# EAGLE design V1.3 (EAGLE 9.1.3)
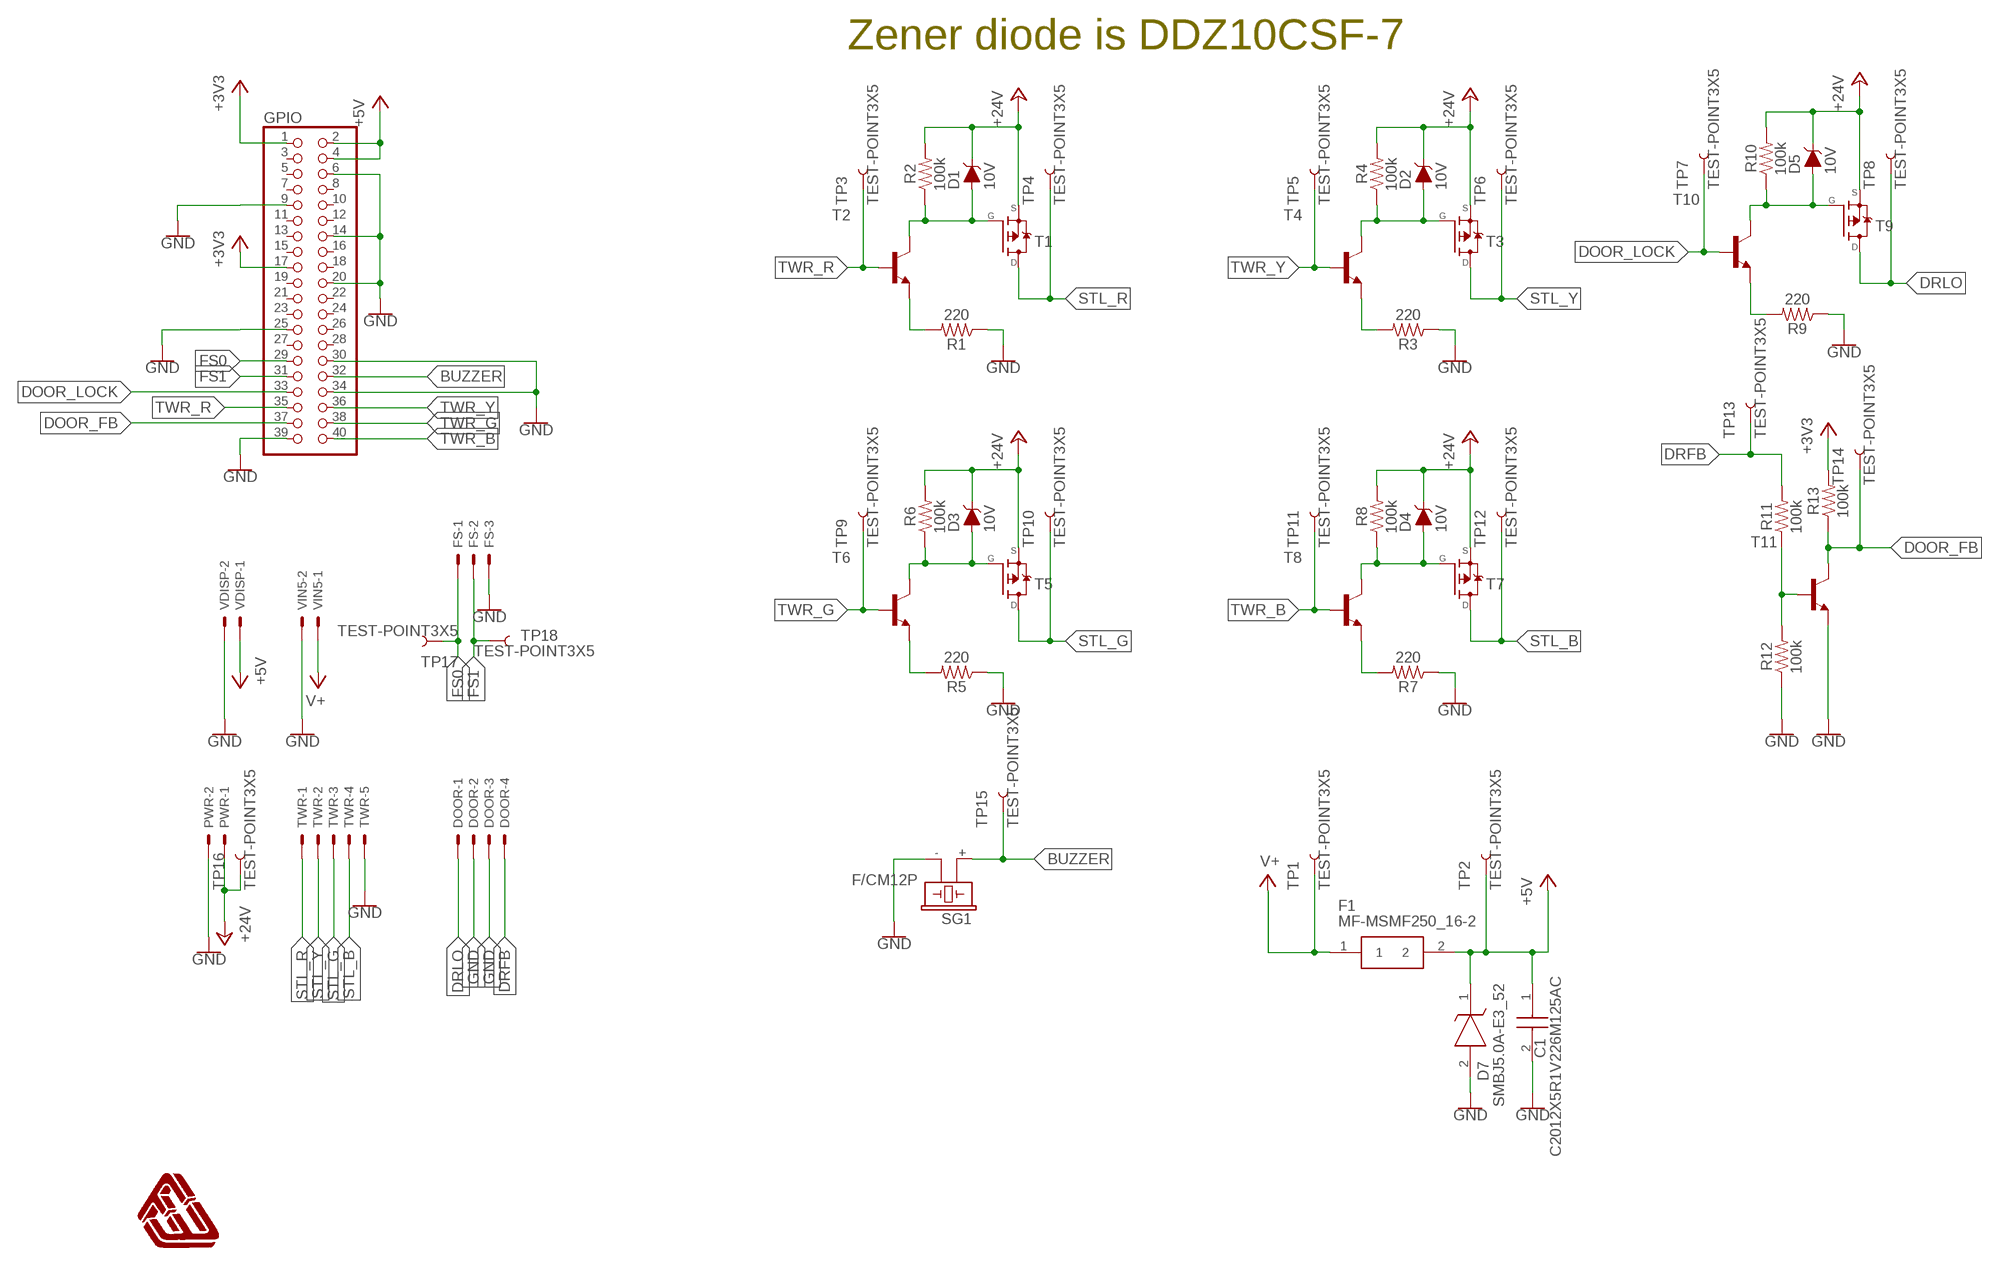
[diagram p0: schematic, sheet 1]

## Parts
C1  C2012X5R1V226M125AC  [CAPC2012X145N]
D1  10V  DIODE-ZENER-DZ2J150M0L  [PANASONIC_SMINI2-F5-B]
D2  10V  DIODE-ZENER-DZ2J150M0L  [PANASONIC_SMINI2-F5-B]
D3  10V  DIODE-ZENER-DZ2J150M0L  [PANASONIC_SMINI2-F5-B]
D4  10V  DIODE-ZENER-DZ2J150M0L  [PANASONIC_SMINI2-F5-B]
D5  10V  DIODE-ZENER-DZ2J150M0L  [PANASONIC_SMINI2-F5-B]
D7  SMBJ5.0A-E3_52  [DIOM5436X244N]
DOOR  JST-XH-04-PIN-LONG-PAD  [JST-XH-04-PACKAGE-LONG-PAD]
F1  MF-MSMF250_16-2  [FUSC4632X160N]
FS  JST-XH-03-PIN-LONG-PAD  [JST-XH-03-PACKAGE-LONG-PAD]
GPIO  RASPBERRYPI_3B_GPIO  [RASPBERRYPI_3B_GPIO]
PWR  JST-XH-02-PIN-LONG-PAD  [JST-XH-02-PACKAGE-LONG-PAD]
R1  220  100KOHM-0603-1/10W-1%  [0603]
R2  100k  100KOHM-0603-1/10W-1%  [0603]
R3  220  100KOHM-0603-1/10W-1%  [0603]
R4  100k  100KOHM-0603-1/10W-1%  [0603]
R5  220  100KOHM-0603-1/10W-1%  [0603]
R6  100k  100KOHM-0603-1/10W-1%  [0603]
R7  220  100KOHM-0603-1/10W-1%  [0603]
R8  100k  100KOHM-0603-1/10W-1%  [0603]
R9  220  100KOHM-0603-1/10W-1%  [0603]
R10  100k  100KOHM-0603-1/10W-1%  [0603]
R11  100k  100KOHM-0603-1/10W-1%  [0603]
R12  100k  100KOHM-0603-1/10W-1%  [0603]
R13  100k  100KOHM-0603-1/10W-1%  [0603]
SG1  F/CM12P  [F/CM12P]
T1  MOSFET_P_SOT223  [MOSFET_SOT223]
T2  MMBT3904LT1-NPN-SOT23-BEC  [SOT23-BEC]
T3  MOSFET_P_SOT223  [MOSFET_SOT223]
T4  MMBT3904LT1-NPN-SOT23-BEC  [SOT23-BEC]
T5  MOSFET_P_SOT223  [MOSFET_SOT223]
T6  MMBT3904LT1-NPN-SOT23-BEC  [SOT23-BEC]
T7  MOSFET_P_SOT223  [MOSFET_SOT223]
T8  MMBT3904LT1-NPN-SOT23-BEC  [SOT23-BEC]
T9  MOSFET_P_SOT223  [MOSFET_SOT223]
T10  MMBT3904LT1-NPN-SOT23-BEC  [SOT23-BEC]
T11  MMBT3904LT1-NPN-SOT23-BEC  [SOT23-BEC]
TP1  TEST-POINT3X5  [PAD.03X.05]
TP2  TEST-POINT3X5  [PAD.03X.05]
TP3  TEST-POINT3X5  [PAD.03X.05]
TP4  TEST-POINT3X5  [PAD.03X.05]
TP5  TEST-POINT3X5  [PAD.03X.05]
TP6  TEST-POINT3X5  [PAD.03X.05]
TP7  TEST-POINT3X5  [PAD.03X.05]
TP8  TEST-POINT3X5  [PAD.03X.05]
TP9  TEST-POINT3X5  [PAD.03X.05]
TP10  TEST-POINT3X5  [PAD.03X.05]
TP11  TEST-POINT3X5  [PAD.03X.05]
TP12  TEST-POINT3X5  [PAD.03X.05]
TP13  TEST-POINT3X5  [PAD.03X.05]
TP14  TEST-POINT3X5  [PAD.03X.05]
TP15  TEST-POINT3X5  [PAD.03X.05]
TP16  TEST-POINT3X5  [PAD.03X.05]
TP17  TEST-POINT3X5  [PAD.03X.05]
TP18  TEST-POINT3X5  [PAD.03X.05]
TWR  JST-XH-05-PIN-LONG-PAD  [JST-XH-05-PACKAGE-LONG-PAD]
U$5  FWLOGO  [FWLOGO]
VDISP  JST-XH-02-PIN-LONG-PAD  [JST-XH-02-PACKAGE-LONG-PAD]
VIN5  JST-XH-02-PIN-LONG-PAD  [JST-XH-02-PACKAGE-LONG-PAD]

## Nets
+3V3: GPIO.1 GPIO.17 R13.2
+5V: C1.1 D7.1(K) F1.2 GPIO.2 GPIO.4 TP2.P$1 VDISP.1
+24V: D1.C D2.C D3.C D4.C D5.C PWR.1 R2.2 R4.2 R6.2 R8.2 R10.2 T1.3(S) T3.3(S) T5.3(S) T7.3(S) T9.3(S) TP16.P$1
BUZZER: GPIO.32 SG1.+ TP15.P$1
DOOR_FB: GPIO.37 R13.1 T11.C TP14.P$1
DOOR_LOCK: GPIO.33 T10.B TP7.P$1
DRFB: DOOR.4 R11.2 TP13.P$1
DRLO: DOOR.1 T9.2(D) T9.4(D) TP8.P$1
FS0: FS.1 GPIO.29 TP17.P$1
FS1: FS.2 GPIO.31 TP18.P$1
GND: C1.2 D7.2(A) DOOR.2 DOOR.3 FS.3 GPIO.6 GPIO.9 GPIO.14 GPIO.20 GPIO.25 GPIO.30 GPIO.34 GPIO.39 PWR.2 R1.1 R3.1 R5.1 R7.1 R9.1 R12.1 SG1.- T11.E TWR.5 VDISP.2 VIN5.2
N$1: R1.2 T2.E
N$3: D2.A R4.1 T3.1(G) T4.C
N$4: D1.A R2.1 T1.1(G) T2.C
N$5: R11.1 R12.2 T11.B
N$8: R3.2 T4.E
N$9: D3.A R6.1 T5.1(G) T6.C
N$10: R5.2 T6.E
N$11: D4.A R8.1 T7.1(G) T8.C
N$12: R7.2 T8.E
N$13: D5.A R10.1 T9.1(G) T10.C
N$14: R9.2 T10.E
STL_B: T7.2(D) T7.4(D) TP12.P$1 TWR.4
STL_G: T5.2(D) T5.4(D) TP10.P$1 TWR.3
STL_R: T1.2(D) T1.4(D) TP4.P$1 TWR.1
STL_Y: T3.2(D) T3.4(D) TP6.P$1 TWR.2
TWR_B: GPIO.40 T8.B TP11.P$1
TWR_G: GPIO.38 T6.B TP9.P$1
TWR_R: GPIO.35 T2.B TP3.P$1
TWR_Y: GPIO.36 T4.B TP5.P$1
V+: F1.1 TP1.P$1 VIN5.1
Unconnected: GPIO.3 GPIO.5 GPIO.7 GPIO.8 GPIO.10 GPIO.11 GPIO.12 GPIO.13 GPIO.15 GPIO.16 GPIO.18 GPIO.19 GPIO.21 GPIO.22 GPIO.23 GPIO.24 GPIO.26 GPIO.27 GPIO.28

## Notes on the sheet
- Zener diode is DDZ10CSF-7

## Library data of the parts
C1 = SamacSys_Parts:C2012X5R1V226M125AC: TDK 0805 C 22uF Ceramic Multilayer Capacitor, 35 V dc, +85C, X5R Dielectric, +/-20% Source: Datasheet <https://product.tdk.com/info/en/catalog/datasheets/mlcc_commercial_midvoltage_en.pdf>; DESCRIPTION: TDK 0805 C 22uF Ceramic Multilayer Capacitor, 35 V dc, +85C, X5R Dielectric, +/-20%; HEIGHT: 1.45mm; MANUFACTURER_NAME: TDK; MANUFACTURER_PART_NUMBER: C2012X5R1V226M125AC; MOUSER_PART_NUMBER: 810-C2012X5R1V226MAC; MOUSER_PRICE-STOCK: https://www.mouser.com/Search/Refine.aspx?Keyword=810-C2012X5R1V226MAC; RS_PART_NUMBER: 9159334P; RS_PRICE-STOCK: http://uk.rs-online.com/web/p/products/9159334P
D1-D5 = SparkFun-DiscreteSemi:DIODE-ZENER: Zener Diode A Zener diode allows current to flow from its anode to its cathode like a normal semiconductor diode, but it also permits current to flow in the reverse direction when its "Zener voltage" is reached. - WIkipedia; PROD_ID: DIO-12989; VALUE: 15V
D7 = SamacSys_Parts:SMBJ5.0A-E3_52: Vishay SMBJ5.0A-E3/52, Uni-Directional TVS Diode, 600W, 2-Pin DO-214AA Source: Datasheet <https://www.vishay.com/docs/88392/smbj.pdf>; ALLIED_NUMBER: 70217303; ALLIED_PRICE-STOCK: https://www.alliedelec.com/generalsemiconductor-vishay-smbj5-0a-e3-52/70217303/; DESCRIPTION: Vishay SMBJ5.0A-E3/52, Uni-Directional TVS Diode, 600W, 2-Pin DO-214AA; HEIGHT: 2.44mm; MANUFACTURER_NAME: Vishay; MANUFACTURER_PART_NUMBER: SMBJ5.0A-E3/52; MOUSER_PART_NUMBER: 625-SMBJ5.0A-E3; MOUSER_PRICE-STOCK: https://www.mouser.com/Search/Refine.aspx?Keyword=625-SMBJ5.0A-E3; RS_PART_NUMBER: 1652507; RS_PRICE-STOCK: http://uk.rs-online.com/web/p/products/1652507
DOOR = Rembrandt:JST-XH-04-PIN: JST XH Connector 2 Pin Wire to board connector. Pitch: 2,54 mm, (0.100") Number of pins: 4 Created by Rembrandt Electronics www.rembrandtelectronics.com
F1 = SamacSys_Parts:MF-MSMF250_16-2: BOURNS - MF-MSMF250/16-2 - FUSE, RESETTABLE PTC, 16V, 2.5A, 1812 Source: Datasheet <https://www.bourns.com/pdfs/mfmsmf.pdf>; DESCRIPTION: BOURNS - MF-MSMF250/16-2 - FUSE, RESETTABLE PTC, 16V, 2.5A, 1812; HEIGHT: 1.6mm; MANUFACTURER_NAME: Bourns; MANUFACTURER_PART_NUMBER: MF-MSMF250/16-2; MOUSER_PART_NUMBER: 652-MF-MSMF250/16-2; MOUSER_PRICE-STOCK: https://www.mouser.com/Search/Refine.aspx?Keyword=652-MF-MSMF250%2F16-2; RS_PART_NUMBER: 6478229P; RS_PRICE-STOCK: http://uk.rs-online.com/web/p/products/6478229P
FS = Rembrandt:JST-XH-03-PIN: JST XH Connector 2 Pin Wire to board connector. Pitch: 2,54 mm, (0.100") Number of pins: 3 Created by Rembrandt Electronics www.rembrandtelectronics.com
GPIO = FracktalWorks:RASPBERRYPI_3B_GPIO
PWR VDISP VIN5 = Rembrandt:JST-XH-02-PIN: JST XH Connector 2 Pin Wire to board connector. Pitch: 2,54 mm, (0.100") Number of pins: 2 Created by Rembrandt Electronics www.rembrandtelectronics.com
R1 R3 R5 R7 R9 = SparkFun-Resistors:100KOHM: 100kΩ resistor A resistor is a passive two-terminal electrical component that implements electrical resistance as a circuit element. Resistors act to reduce current flow, and, at the same time, act to lower voltage levels within circuits. - Wikipedia; PROD_ID: RES-07828; VALUE: 100k
R2 R4 R6 R8 R10-R13 = SparkFun-Resistors:100KOHM: 100kΩ resistor A resistor is a passive two-terminal electrical component that implements electrical resistance as a circuit element. Resistors act to reduce current flow, and, at the same time, act to lower voltage levels within circuits. - Wikipedia; PROD_ID: RES-07828
SG1 = buzzer:F/CM12P: BUZZER Source: Buerklin; OC_FARNELL: unknown; OC_NEWARK: unknown
T1 T3 T5 T7 T9 = FracktalWorks:MOSFET_P_SOT223: MOSFET P channel SOT-223 device
T2 T4 T6 T8 T10 T11 = transistor:*-NPN-: NPN Transistror BF959 corrected 2008.03.06
TP1-TP18 = SparkFun-Connectors:TEST-POINT: SparkFun Test Points Bare copper test points for troubleshooting or In-Circuit-Testing. These are used by our Production team for verifying production board runs using pogo-pins on test beds. SparkFun Products: SparkFun LSM9DS1 Breakout <https://www.sparkfun.com/products/13284> SparkFun PSOC <https://www.sparkfun.com/products/13714> SparkFun Load Cell Amplifier <https://www.sparkfun.com/products/13879>
TWR = Rembrandt:JST-XH-05-PIN: JST XH Connector 2 Pin Wire to board connector. Pitch: 2,54 mm, (0.100") Number of pins: 5 Created by Rembrandt Electronics www.rembrandtelectronics.com
U$5 = FracktalWorks:FWLOGO

## Board
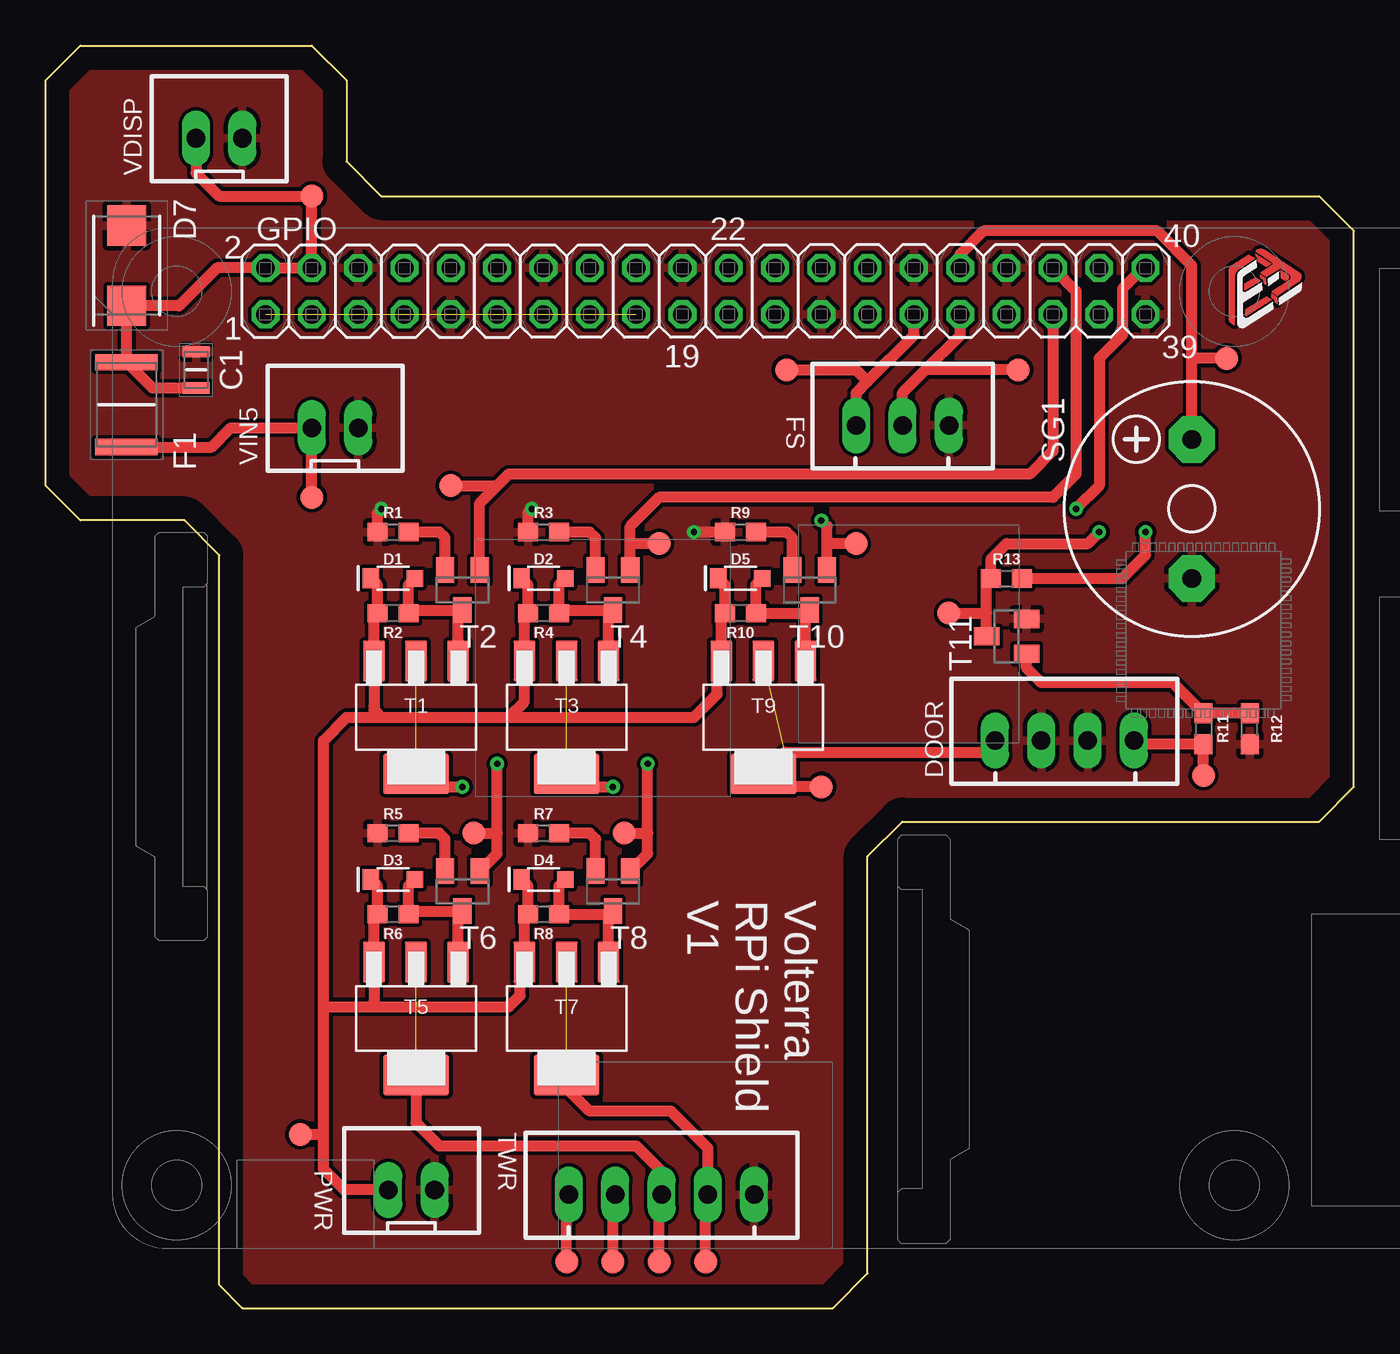
[diagram p1: board, top side]
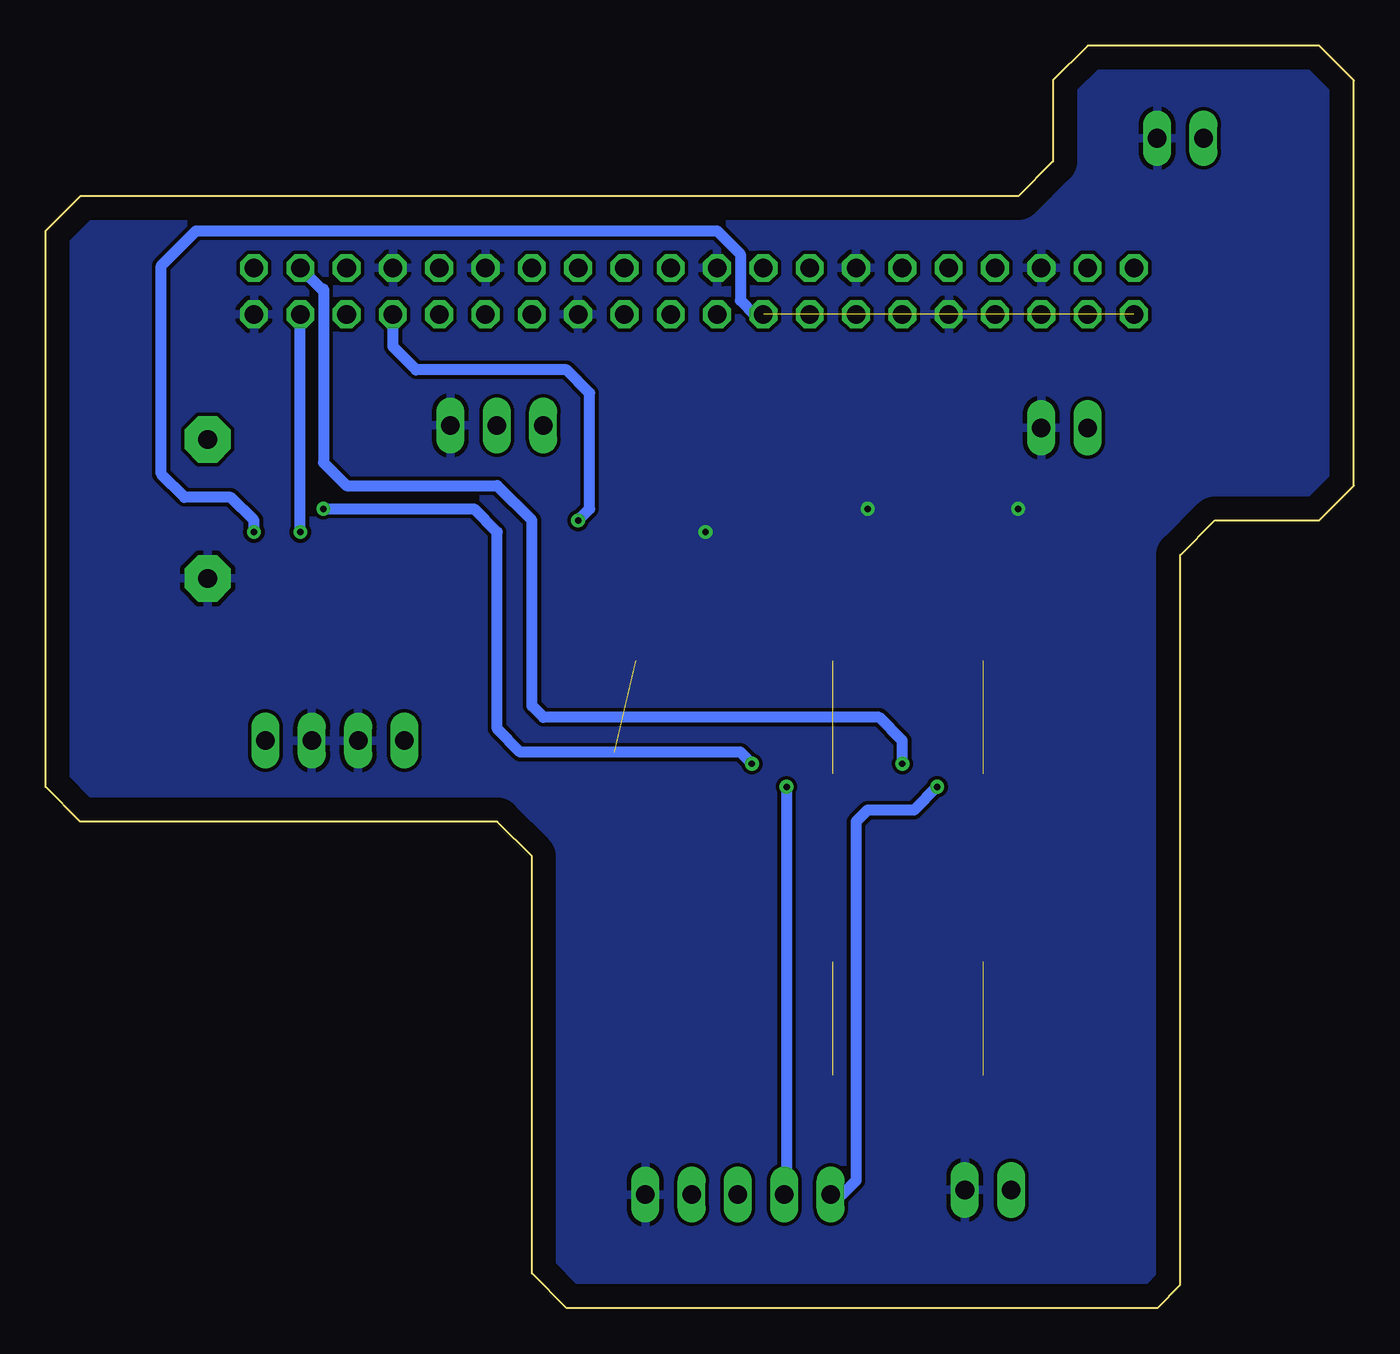
[diagram p2: board, bottom side, seen from below]

Size 71.75 x 69.22 mm. Coordinates in mm from the lower left corner, seen from the top.
Outline: 10.79,0 43.18,0 45.09,1.9 45.09,24.77 46.99,26.67 69.85,26.67 71.75,28.57 71.75,59.06 69.85,60.96 18.41,60.96 16.51,62.86 16.51,67.31 14.61,69.22 1.91,69.22 0,67.31 0,45.08 1.91,43.18 7.62,43.18 9.53,41.28 9.53,1.27 10.79,0
Copper layers (1*16): Top 0.035mm / dielectric 1.5mm / Bottom 0.035mm
Design rules "LionCircuits": minimum track width 8mil, minimum drill 0.35mm, track to track 8mil, track to pad 8mil, pad to pad 8mil, via to via 8mil, smd to smd 8mil, copper to edge 50mil, drill to drill 10mil, minimum pad ring 10mil, minimum via ring 8mil, stop-mask expansion 4mil, vias tented up to drill 0mil, thermal gap 10mil

### Footprints (pad centres in the part's own frame; a part is rotated, then mirrored left to right if it is on the bottom)
CAPC2012X145N = smd 0.62 x 1.47: 1 -1,0; 2 1,0
PANASONIC_SMINI2-F5-B = smd 0.9 x 0.9: A 1.2,0 | smd 0.9 x 1.1: C -1.2,0
DIOM5436X244N = smd 2.2 x 2.15: 1 -2.2,0; 2 2.2,0
JST-XH-04-PACKAGE-LONG-PAD = drill 1.016 long: 1 -3.81,0; 2 -1.27,0; 3 1.27,0; 4 3.81,0
FUSC4632X160N = smd 0.89 x 3.43: 1 -2.325,0; 2 2.325,0
JST-XH-03-PACKAGE-LONG-PAD = drill 1.016 long: 1 -2.54,0; 2 0,0; 3 2.54,0
RASPBERRYPI_3B_GPIO = drill 1.016 octagon: 1 -24.13,-1.27; 2 -24.13,1.27; 3 -21.59,-1.27; 4 -21.59,1.27; 5 -19.05,-1.27; 6 -19.05,1.27; 7 -16.51,-1.27; 8 -16.51,1.27; 9 -13.97,-1.27; 10 -13.97,1.27; 11 -11.43,-1.27; 12 -11.43,1.27; 13 -8.89,-1.27; 14 -8.89,1.27; 15 -6.35,-1.27; 16 -6.35,1.27; 17 -3.81,-1.27; 18 -3.81,1.27; 19 -1.27,-1.27; 20 -1.27,1.27; 21 1.27,-1.27; 22 1.27,1.27; 23 3.81,-1.27; 24 3.81,1.27; 25 6.35,-1.27; 26 6.35,1.27; 27 8.89,-1.27; 28 8.89,1.27; 29 11.43,-1.27; 30 11.43,1.27; 31 13.97,-1.27; 32 13.97,1.27; 33 16.51,-1.27; 34 16.51,1.27; 35 19.05,-1.27; 36 19.05,1.27; 37 21.59,-1.27; 38 21.59,1.27; 39 24.13,-1.27; 40 24.13,1.27
JST-XH-02-PACKAGE-LONG-PAD = drill 1.016 long: 1 -1.27,0; 2 1.27,0
0603 = smd 1.1 x 1: 1 -0.85,0; 2 0.85,0
F/CM12P = drill 1.016 pad 2.54 octagon: + 3.81,0; - -3.81,0
MOSFET_SOT223 = smd 2.235 x 1.219: 1 -3.099,2.311; 2 -3.099,0; 3 -3.099,-2.311 | smd 2.2 x 3.6: 4 3.099,0
SOT23-BEC = smd 1 x 1.4: B -0.95,-1.1; C 0,1.1; E 0.95,-1.1
PAD.03X.05 = smd 1.27 x 1.27: P$1 0,0
JST-XH-05-PACKAGE-LONG-PAD = drill 1.016 long: 1 -5.08,0; 2 -2.54,0; 3 0,0; 4 2.54,0; 5 5.08,0

### Placement (x,y rotation side)
C1  8.26,51.44 90 top
D1  19.05,40 0 top
D2  27.3,40 0 top
D3  19.05,23.5 0 top
D4  27.3,23.5 0 top
D5  38.1,40 0 top
D7  4.44,57.15 90 top
DOOR  55.88,31.11 0 top
F1  4.44,49.53 90 top
FS  47,48.39 0 top
GPIO  36.2,55.75 0 top
PWR  20.07,6.48 0 top
R1  19.05,42.55 0 top
R2  19.05,38.1 180 top
R3  27.3,42.55 0 top
R4  27.3,38.1 180 top
R5  19.05,26.04 0 top
R6  19.05,21.59 180 top
R7  27.3,26.04 0 top
R8  27.3,21.59 180 top
R9  38.1,42.55 0 top
R10  38.1,38.1 180 top
R11  63.5,31.75 270 top
R12  66.04,31.75 90 top
R13  52.7,40 0 top
SG1  62.86,43.81 90 top
T1  20.32,32.39 270 top
T2  22.86,39.37 180 top
T3  28.57,32.39 270 top
T4  31.12,39.37 180 top
T5  20.32,15.88 270 top
T6  22.86,22.86 180 top
T7  28.57,15.88 270 top
T8  31.12,22.86 180 top
T9  39.37,32.39 270 top
T10  41.91,39.37 180 top
T11  52.7,36.83 90 top
TP1  14.61,44.45 0 top
TP2  14.61,60.96 0 top
TP3  22.22,45.08 0 top
TP4  28.57,2.54 0 top
TP5  33.66,41.91 0 top
TP6  31.12,2.54 0 top
TP7  44.45,41.91 0 top
TP8  42.55,28.57 0 top
TP9  23.49,26.04 0 top
TP10  33.66,2.54 0 top
TP11  31.75,26.04 0 top
TP12  36.2,2.54 0 top
TP13  63.5,29.21 0 top
TP14  49.53,38.1 0 top
TP15  64.77,52.07 0 top
TP16  13.97,9.53 0 top
TP17  40.64,51.44 0 top
TP18  53.34,51.44 0 top
TWR  33.78,6.22 0 top
U$5  63.75,59.56 270 top
VDISP  9.53,64.14 0 top
VIN5  15.88,48.26 0 top

### Tracks (layer width: path | path; a pad name or v marks a point on that pad's centre or on a via)
+3V3  (via drill 0.35)  (1 unrouted)
  Top 0.61: R13.2 59.05,40 60.32,41.28 v60.32,42.55
  Bottom 0.61: v60.32,42.55 60.32,43.18 61.59,44.45 64.14,44.45 65.41,45.72 65.41,57.15 63.5,59.06 34.92,59.06 33.66,57.78 33.66,55.25 32.89,54.48 GPIO.17
+5V
  Top 0.61: C1.1 5.86,50.44 F1.2 D7.1 7.33,54.95 9.4,57.02 GPIO.2 GPIO.4 TP2.P$1 9.53,60.96 8.26,62.23 VDISP.1
+24V
  Top 0.61: D1.C 18.2,39.66 R2.2 18.01,37.91 T1.3 18.01,33.02 18.01,32.79 18.41,32.39 | D2.C 26.45,39.66 R4.2 26.26,37.91 T3.3 26.26,33.25 25.4,32.39 | D3.C 18.2,23.14 R6.2 18.01,21.4 T5.3 18.01,16.74 17.78,16.51 | D4.C 26.45,23.14 R8.2 26.26,21.4 T7.3 26.04,18.74 26.04,17.14 25.4,16.51 17.78,16.51 | 37.06,37.91 R10.2 | R10.2 37.25,39.66 D5.C | PWR.1 16.38,6.48 15.24,7.62 15.24,9.53 | 15.24,9.53 15.24,16.51 | 15.24,16.51 17.78,16.51 | 15.24,16.51 15.24,31.11 16.51,32.39 18.41,32.39 | 18.41,32.39 25.4,32.39 | 25.4,32.39 35.56,32.39 36.83,33.66 36.83,35.25 T9.3 37.06,37.91 | 37.06,37.91 R10.2 | TP16.P$1 15.24,9.53
BUZZER
  Top 0.61: SG1.+ 62.86,52.07 | 62.86,52.07 62.86,57.15 60.96,59.06 51.44,59.06 50.16,57.78 GPIO.32 | TP15.P$1 62.86,52.07
DOOR_FB  (via drill 0.35)
  Top 0.61: T11.C 51.6,38.1 | 51.6,38.1 51.6,39.75 R13.1 51.85,41.06 52.7,41.91 57.15,41.91 v57.78,42.55 | TP14.P$1 51.6,38.1
  Bottom 0.61: v57.78,42.55 GPIO.37
DOOR_LOCK  (via drill 0.35)
  Top 0.61: T10.B 42.86,41.91 | 42.86,41.91 42.86,42.86 v42.55,43.18 | TP7.P$1 42.86,41.91
  Bottom 0.61: v42.55,43.18 41.91,43.81 41.91,50.17 43.18,51.44 51.44,51.44 52.7,52.7 GPIO.33
DRFB
  Top 0.61: TP13.P$1 R11.2 59.91,30.9 DOOR.4
DRLO  (1 unrouted)
  Top 0.61: T9.4 39.65,29.57 | 39.65,29.57 40.56,30.48 51.44,30.48 DOOR.1 | TP8.P$1 40.64,28.57 39.65,29.57
FS0
  Top 0.61: FS.1 44.46,50.18 45.09,50.8 | GPIO.29 47.62,53.34 45.09,50.8 | TP17.P$1 44.45,51.44 45.09,50.8
FS1
  Top 0.61: FS.2 47,50.18 48.26,51.44 | GPIO.31 50.16,53.34 48.26,51.44 | TP18.P$1 48.26,51.44
GND  (via drill 0.35)
  Top 0.61: R1.1 18.2,43.6 v18.41,43.81 | R3.1 26.45,43.6 v26.67,43.81 | R9.1 v35.56,42.55
  pour Top: 0,69.22 0,0 71.75,0 71.75,69.22
  pour Bottom: 0,69.22 0,0 71.75,0 71.75,69.22
N$1
  Top 0.61: T2.E 21.91,42.22 21.59,42.55 R1.2
N$3
  Top 0.61: D2.A 28.15,39.66 R4.1 28.32,38.27 T4.C 30.89,38.04 T3.1
N$4
  Top 0.61: D1.A 19.9,39.66 R2.1 20.07,38.27 T2.C 22.63,38.04 T1.1
N$5
  Top 0.61: T11.B 53.8,35.09 54.61,34.29 61.81,34.29 R11.1 R12.2
N$8
  Top 0.61: T4.E 30.16,42.22 29.84,42.55 R3.2
N$9
  Top 0.61: D3.A 19.9,23.14 R6.1 20.07,21.76 T6.C 22.63,21.53 T5.1
N$10
  Top 0.61: T6.E 21.91,25.71 21.59,26.04 R5.2
N$11
  Top 0.61: D4.A 28.15,23.14 R8.1 31.12,21.59 | 31.12,21.59 T8.C | T7.1 30.89,21.36 31.12,21.59
N$12
  Top 0.61: T8.E 30.16,25.71 29.84,26.04 R7.2
N$13
  Top 0.61: D5.A 38.95,39.66 R10.1 41.74,38.1 T10.C 41.68,38.04 T9.1
N$14
  Top 0.61: T10.E 40.96,42.22 40.64,42.55 R9.2
STL_B  (1 unrouted)
  Top 0.61: T7.4 28.57,12.06 29.84,10.79 34.29,10.79 36.32,8.76 TWR.4 36.2,6.1 TP12.P$1
STL_G  (1 unrouted)
  Top 0.61: T5.4 20.32,10.16 21.59,8.89 32.38,8.89 33.78,7.49 TWR.3 33.66,6.1 TP10.P$1
STL_R  (via drill 0.35)  (1 unrouted)
  Top 0.61: T1.4 21.03,28.57 v22.86,28.57 | TP4.P$1 28.57,6.1 TWR.1
  Bottom 0.61: v22.86,28.57 24.13,27.3 26.67,27.3 27.3,26.67 27.3,6.98 28.07,6.22 TWR.1
STL_Y  (via drill 0.35)  (1 unrouted)
  Top 0.61: T3.4 29.29,28.57 v31.12,28.57 | TP6.P$1 31.12,6.1 TWR.2
  Bottom 0.61: v31.12,28.57 31.12,6.35 TWR.2
TWR_B  (via drill 0.35)
  Top 0.61: T8.B 33.02,24.91 33.02,26.04 | 33.02,26.04 v33.02,29.84 | GPIO.40 60.2,57.02 59.05,55.88 | v56.52,43.81 57.78,45.08 57.78,52.07 59.05,53.34 59.05,55.88 | 59.05,55.88 | TP11.P$1 33.02,26.04
  Bottom 0.61: v56.52,43.81 48.26,43.81 46.99,42.55 46.99,31.75 45.72,30.48 33.66,30.48 v33.02,29.84
TWR_G  (via drill 0.35)
  Top 0.61: T6.B 24.77,24.91 24.77,26.04 | 24.77,26.04 v24.77,29.84 | TP9.P$1 24.77,26.04
  Bottom 0.61: v24.77,29.84 24.77,31.11 26.04,32.39 44.45,32.39 45.09,33.02 45.09,43.18 46.99,45.08 55.24,45.08 56.52,46.36 56.52,55.88 56.64,55.88 GPIO.38
TWR_R
  Top 0.61: T2.B 23.81,44.13 24.77,45.08 | 24.77,45.08 25.4,45.72 53.98,45.72 55.24,46.99 GPIO.35 | TP3.P$1 24.77,45.08
TWR_Y
  Top 0.61: T4.B 32.06,41.91 | 32.06,41.91 32.06,42.86 33.66,44.45 55.24,44.45 56.52,45.72 56.52,55.75 GPIO.36 | TP5.P$1 32.06,41.91
V+
  Top 0.61: F1.1 9.11,47.2 10.16,48.26 VIN5.1 TP1.P$1

### Text on the board
tPlace: Volterra / RPi Shield / V1
tNames: 22 | 2 | 40 | 1 | 19 | 39